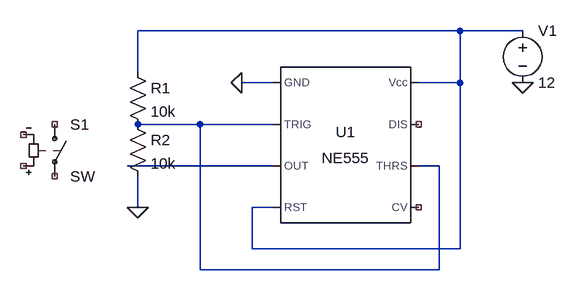
[diagram p0: schematic momentary switchh.asc]
momentary switchh.asc, the LTspice schematic file:
Version 4
SHEET 1 880 680
WIRE 224 -96 -272 -96
WIRE 320 -96 224 -96
WIRE -272 -32 -272 -96
WIRE -64 -16 -112 -16
WIRE 224 -16 224 -96
WIRE 224 -16 160 -16
WIRE -176 48 -272 48
WIRE -64 48 -176 48
WIRE -64 112 -288 112
WIRE 192 112 160 112
WIRE -272 176 -272 128
WIRE -64 176 -96 176
WIRE -96 240 -96 176
WIRE 224 240 224 -16
WIRE 224 240 -96 240
WIRE -176 272 -176 48
WIRE 192 272 192 112
WIRE 192 272 -176 272
FLAG -112 -16 0
FLAG -272 176 0
FLAG 320 -16 0
SYMBOL Misc\\NE555 48 80 R0
SYMATTR InstName U1
SYMBOL res -288 -48 R0
SYMATTR InstName R1
SYMATTR Value 10k
SYMBOL res -288 32 R0
SYMATTR InstName R2
SYMATTR Value 10k
SYMBOL voltage 320 -112 R0
WINDOW 123 0 0 Left 0
WINDOW 39 0 0 Left 0
SYMATTR InstName V1
SYMATTR Value 12
SYMBOL sw -400 32 R0
SYMATTR InstName S1

The netlist it stands for:
* momentary switchh.asc
XU1 0 N002 N003 N001 NC_01 N002 NC_02 N001 NE555  ; pins GND TRIG OUT RST CV THRS DIS Vcc
R1 N001 N002 10k
R2 N002 0 10k
V1 N001 0 12
S1 NC_03 NC_04 NC_05 NC_06 SW
.lib NE555.sub
.backanno
.end